# Altium schematic sheet Sheet1.SchDoc
size A4
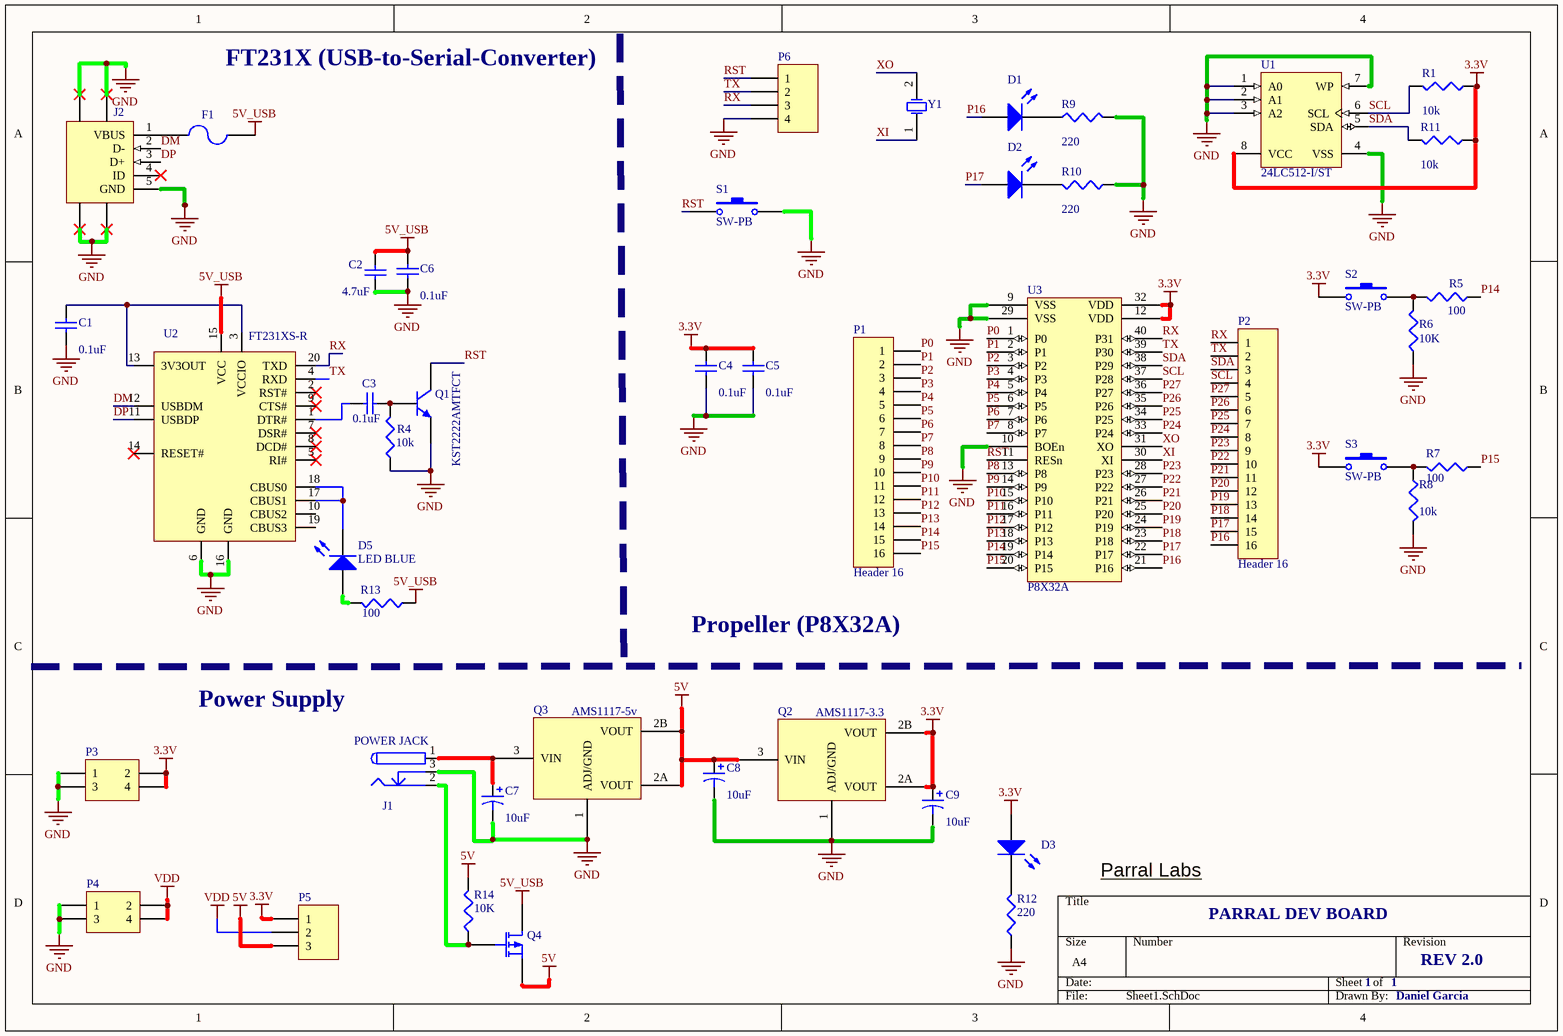
[diagram p0: Sheet1.SchDoc]

## Parts
C1  0.1uF  [0603 - Old1]
C2  4.7uF  [0603 - Old1]
C3  0.1uF  [0603 - Old1]
C4  0.1uF  [0603 - Old1]
C5  0.1uF  [0603 - Old1]
C6  0.1uF  [0603 - Old1]
C7  10uF  [C0805]
C8  10uF  [C0805]
C9  10uF  [C0805]
D1  LED GREEN  [LED-0603]  (value not drawn)
D2  LED BLUE  [LED-0603]  (value not drawn)
D3  LED RED  [LED-0603]  (value not drawn)
D5  LED BLUE  [LED-0603]
F1  PTC  [MF-MSMF050-2]  (value not drawn)
J1  POWER JACK  [PWR JACK]
J2  USB - micro B  [micro B USB 2.0]  (value not drawn)
P1  Header 16  [HDR1X16]
P2  Header 16  [HDR1X16]
P3  Header 2X2  [HDR2X2]  (value not drawn)
P4  Header 2X2  [HDR2X2]  (value not drawn)
P5  Header 3  [HDR1X3]  (value not drawn)
P6  Header 4  [HDR1X4]  (value not drawn)
Q1  KST2222AMTFCT  [SOT-23B_N]
Q2  AMS1117-3.3  [SOT223_M]
Q3  AMS1117-5v  [SOT223_M]
Q4  ZXMP6A13FTA  [SOT-23-3]  (value not drawn)
R1  10K  [0603-Resistor]
R4  10K  [0603-Resistor]
R5  100  [0603-Resistor]
R6  10K  [0603-Resistor]
R7  100  [0603-Resistor]
R8  10K  [0603-Resistor]
R9  220  [0603-Resistor]
R10  220  [0603-Resistor]
R11  10K  [0603-Resistor]
R12  220  [0603-Resistor]
R13  100  [0603-Resistor]
R14  10K  [0603-Resistor]
S1  SW-PB  [PTS810]
S2  SW-PB  [PTS810]
S3  SW-PB  [PTS810]
U1  24LC512-I/ST  [SOIC-8]
U2  FT231XS-R
U3  P8X32A  [DIP-40]
Y1  XTAL 5MHZ  [XTAL-2]  (value not drawn)

## Nets
3.3V: C4.2 C5.2 C9.1 D3.1(A) P3.2 P3.4 P5.1 Q2.2A(VOUT) Q2.2B(VOUT) R1.1 R11.1 S2.1 S3.1 U1.8(VCC) U3.12(VDD) U3.32(VDD)
5V: C8.1 P5.3 Q2.3(VIN) Q3.2A(VOUT) Q3.2B(VOUT) Q4.2(S) R14.2
5V_USB: C2.2 C6.2 F1.2 Q4.3(D) R13.1 U2.15(VCC)
GND: C1.1 C2.1 C4.1 C5.1 C6.1 C7.2 C8.2 C9.2 J1.3 J2.5(GND) J2.6 J2.7 J2.8 J2.9 P3.1 P3.3 P4.1 P4.3 P6.4 Q1.2(E) Q2.1(ADJ/GND) Q3.1(ADJ/GND) R4.1 R6.1 R8.2 R9.2 R10.1 R12.1 S1.2 U1.1(A0) U1.2(A1) U1.3(A2) U1.4(VSS) U1.7(WP) U2.6(GND) U2.16(GND) U3.9(VSS) U3.10(BOEn) U3.29(VSS)
VDD: P4.2 P4.4 P5.2
DM: J2.2(D-) U2.12(USBDM)
DP: J2.3(D+) U2.11(USBDP)
P0: P1.1 U3.1(P0)
P1: P1.2 U3.2(P1)
P2: P1.3 U3.3(P2)
P3: P1.4 U3.4(P3)
P4: P1.5 U3.5(P4)
P5: P1.6 U3.6(P5)
P6: P1.7 U3.7(P6)
P7: P1.8 U3.8(P7)
P8: P1.9 U3.13(P8)
P9: P1.10 U3.14(P9)
P10: P1.11 U3.15(P10)
P11: P1.12 U3.16(P11)
P12: P1.13 U3.17(P12)
P13: P1.14 U3.18(P13)
P14: P1.15 R5.1 U3.19(P14)
P15: P1.16 R7.1 U3.20(P15)
P16: D1.1(A) P2.16 U3.21(P16)
P17: D2.1(A) P2.15 U3.22(P17)
P18: P2.14 U3.23(P18)
P19: P2.13 U3.24(P19)
P20: P2.12 U3.25(P20)
P21: P2.11 U3.26(P21)
P22: P2.10 U3.27(P22)
P23: P2.9 U3.28(P23)
P24: P2.8 U3.33(P24)
P25: P2.7 U3.34(P25)
P26: P2.6 U3.35(P26)
P27: P2.5 U3.36(P27)
RST: P6.1 Q1.3(C) S1.1 U3.11(RESn)
RX: P2.1 P6.3 U2.20(TXD) U3.40(P31)
SCL: P2.4 R1.2 U1.6(SCL) U3.37(P28)
SDA: P2.3 R11.2 U1.5(SDA) U3.38(P29)
TX: P2.2 P6.2 U2.4(RXD) U3.39(P30)
XI: U3.30(XI) Y1.1(OSC1)
XO: U3.31(XO) Y1.2(OSC2)
NetC1_2: C1.2 U2.3(VCCIO) U2.13(3V3OUT)
NetC3_1: C3.1 U2.1(DTR#)
NetC3_2: C3.2 Q1.1(B) R4.2
NetC7_1: C7.1 J1.1 Q3.3(VIN)
NetD1_2: D1.2(K) R9.1
NetD2_2: D2.2(K) R10.2
NetD3_2: D3.2(K) R12.2
NetD5_1: D5.1(A) R13.2
NetD5_2: D5.2(K) U2.17(CBUS1) U2.18(CBUS0)
NetF1_1: F1.1 J2.1(VBUS)
NetJ1_2: J1.2 Q4.1(G) R14.1
NetR5_2: R5.2 R6.2 S2.2
NetR7_2: R7.2 R8.1 S3.2

Not connected (* = marked no-connect by the designer): J2 4(ID)*; U2 2(RST#)* 5(RI#)* 7(DSR#)* 8(DCD#)* 9(CTS#)* 10(CBUS2) 14(RESET#)* 19(CBUS3)

## Notes on the sheet
- FT231X (USB-to-Serial-Converter)
- Propeller (P8X32A)
- Power Supply
- Parral Labs
- PARRAL DEV BOARD
- 1
- REV 2.0
- Daniel Garcia

## Library data of the parts
C1 C3 C4 C6 = Cap Semi: 0.1uF Capacitor 0603; PartNumber: 478-1395-1-ND; Published: 8-Jun-2000; LatestRevisionDate: 29-May-2009; LatestRevisionNote: IPC-7351 Footprint Added.; PackageReference: 0603; Publisher: Altium Limited; PackageDescription: Chip Capacitor; Value: 0.1uF
C2 = Cap Semi: 4.7µF 25V Ceramic Capacitor X5R 0603; ManufacturerPartNumber: CL21A475KAQNNNE; Published: 8-Jun-2000; LatestRevisionDate: 29-May-2009; LatestRevisionNote: IPC-7351 Footprint Added.; PackageReference: 0603; Publisher: Altium Limited; PackageDescription: Chip Capacitor; Value: 4.7uF
C5 = Cap Semi: 0.1uF Capacitor 0603; Partnumber: 478-1395-1-ND; Published: 8-Jun-2000; LatestRevisionDate: 29-May-2009; LatestRevisionNote: IPC-7351 Footprint Added.; PackageReference: 0603; Publisher: Altium Limited; PackageDescription: Chip Capacitor; Value: 0.1uF
C7-C9 = Cap Pol3: 10µF Molded Tantalum Capacitors 10V 0805; PartNumber: 399-3684-1-ND; Published: 8-Jun-2000; LatestRevisionDate: 29-May-2009; LatestRevisionNote: IPC-7351 Footprint Added.; PackageReference: 0805; Publisher: Altium Limited; PackageDescription: Chip Capacitor; Value: 10uF
D1 D3 = LED2: LED 0603; Published: 8-Jun-2000; LatestRevisionDate: 17-Jul-2002; LatestRevisionNote: Re-released for DXP Platform.; PackageVersion: Feb-2002; PackageReference: 3.2X1.6X1.1; Publisher: Altium Limited; PackageDescription: SM LED; 2 Flat Leads
D2 D5 = LED0: LED 0603; Published: 8-Jun-2000; LatestRevisionDate: 08-Jul-2005; LatestRevisionNote: Mech Layer 1 removed.; PackageReference: LED-0; Publisher: Altium Limited; PackageDescription: LED; 2 Leads
F1 = Fuse 2: PTC RESETTABLE .50A 15V 1812; Manufacturer: Bourns Inc.; Current - Trip (It): 1A; Current - Hold (Ih) (Max): 500mA; Published: 8-Jun-2000; LatestRevisionDate: 17-Jul-2002; LatestRevisionNote: Re-released for DXP Platform.; Package / Case: 1812 (4532 Metric), Concave; Publisher: Altium Limited; PackageDescription: Thru-Hole; 2 Leads; Manufacturer Part Number: MF-MSMF050-2; Voltage - Max: 15V
J1 = Component_1: POWER JACK 5.5x2.1mm
J2 = USB MICRO B RECPT SMT: CONN USB MICRO B RECPT SMT R/A; Manufacturer Part Number: 10118192-0001LF; PartNumber: 609-4613-1-ND; Manufacturer: Amphenol FCI; Mounting Type: Surface Mount, Right Angle
P1 P2 = Header 16: Header, 16-Pin; LatestRevisionDate: 17-Jul-2002; LatestRevisionNote: Re-released for DXP Platform.; Publisher: Altium Limited
P3 P4 = Header 2X2: Header, 2-Pin, Dual row; LatestRevisionDate: 17-Jul-2002; LatestRevisionNote: Re-released for DXP Platform.; Publisher: Altium Limited
P5 = Header 3: Header, 3-Pin; LatestRevisionDate: 17-Jul-2002; LatestRevisionNote: Re-released for DXP Platform.; Publisher: Altium Limited
P6 = Header 4: Header, 4-Pin; LatestRevisionDate: 17-Jul-2002; LatestRevisionNote: Re-released for DXP Platform.; Publisher: Altium Limited
Q1 = QNPN: TRANS NPN 40V 0.6A SOT-23; Manufacturer: Fairchild/ON Semiconductor; Published: 8-Jun-2000; LatestRevisionDate: 29-May-2009; LatestRevisionNote: IPC-7351 Footprint Added.; PackageVersion: Aug-1999; PackageReference: SOT-23-3; Publisher: Altium Limited; PackageDescription: 3-Pin SOT-23 Package 0.95 mm Pitch, 2.4 mm Lead Span; Manufacturer Part Number: KST2222AMTF; Transistor Type: NPN
Q2 = AP1117E33GDICT-ND: Linear Voltage Regulator IC Positive Fixed 1 Output 3.3V; Manufacturer: Advanced Monolithic Systems; Current: 1A; Manufacturer Part Number: AMS1117-3.3; Package: SOT-223-3; Voltage - Output: 3.3V; Mounting Type: Surface Mount
Q3 = AP1117E33GDICT-ND: Linear Voltage Regulator IC Positive Fixed 1 Output 3.3V; Manufacturer Part Number: AMS1117-5.0; Manufacturer: Advanced Monolithic Systems; Voltage - Output: 5V; Current: 1A; Package: SOT-223-3; Mounting Type: Surface Mount
Q4 = MOSFET-P: MOSFET P-CH 60V 0.9A SOT23-3; Published: 8-Jun-2000; LatestRevisionDate: 17-Jul-2002; LatestRevisionNote: Re-released for DXP Platform.; PackageVersion: 1995/1996; PackageReference: E3; Publisher: Altium Limited; PackageDescription: TO, Flat Index; 3 In-Line, Axial Leads; Body Dia. 4.6mm; Lead Dia. 0.5 mm (max); Digi-Key Part Numbe: ZXMP6A13FCT-ND; Supplier Device Package: SOT-23-3
R1 R4 R8 R11 R14 = Res3: RES SMD 10K OHM 5% 1/4W 0603; Published: 8-Jun-2000; LatestRevisionDate: 29-May-2009; LatestRevisionNote: IPC-7351 Footprint Added.; PackageReference: J1-0603; Publisher: Altium Limited; PackageDescription: Chip Resistor
  R1 R4 R8 R11: Value: 10k
  R14: Value: 10K
R5 = Res3: RES SMD 100 OHM 5% 1/4W 0603; PartNumber: RMCF1206JT100RCT-ND; Published: 8-Jun-2000; LatestRevisionDate: 29-May-2009; LatestRevisionNote: IPC-7351 Footprint Added.; PackageReference: J1-0603; Publisher: Altium Limited; PackageDescription: Chip Resistor; Value: 100
R6 = Res3: RES SMD 10K OHM 5% 1/4W 0603; PartNumber: 311-10KERCT-ND; Published: 8-Jun-2000; LatestRevisionDate: 29-May-2009; LatestRevisionNote: IPC-7351 Footprint Added.; PackageReference: J1-0603; Publisher: Altium Limited; PackageDescription: Chip Resistor; Value: 10k
R7 R13 = Res3: RES SMD 100 OHM 5% 1/4W 0603; Published: 8-Jun-2000; LatestRevisionDate: 29-May-2009; LatestRevisionNote: IPC-7351 Footprint Added.; PackageReference: J1-0603; Publisher: Altium Limited; PackageDescription: Chip Resistor; Value: 100
R9 R10 = Res3: RES SMD 220 OHM 5% 1/4W 0603; Published: 8-Jun-2000; LatestRevisionDate: 29-May-2009; LatestRevisionNote: IPC-7351 Footprint Added.; PackageReference: J1-0603; Publisher: Altium Limited; PackageDescription: Chip Resistor; Value: 220
R12 = Res3: RES SMD 220 OHM 5% 1/4W 0603; PartNumber: er  P220ECT-ND; Published: 8-Jun-2000; LatestRevisionDate: 29-May-2009; LatestRevisionNote: IPC-7351 Footprint Added.; PackageReference: J1-0603; Publisher: Altium Limited; PackageDescription: Chip Resistor; Value: 220
S1-S3 = SW-PB: SWITCH TACTILE SPST-NO 0.05A 12V; Manufacturer Part Number: B3U-1000P; Manufacturer: Omron Electronics Inc-EMC Div; Published: 24-Mar-1999; LatestRevisionDate: 17-Jul-2002; LatestRevisionNote: Re-released for DXP Platform.; PackageReference: SPST-2; Publisher: Altium Limited; PackageDescription: Switch; 2 Leads
U1 = 24LC256-I/ST: IC EEPROM 512KBIT 400KHZ 8SOIJ; Manufacturer Part Number: 24LC512-I/ST-ND; Published: 29-Jan-2009; DatasheetVersion: revP, Oct-2007; PackageVersion: revBB, Aug-2009; PackageReference: TSSOP-ST8; Publisher: Altium Limited; PackageDescription: 8-Lead Plastic Thin Shrink Small Outline (ST) - 4.4mm Body [TSSOP]; Supplier 1: Digi-Key; Supplier 2: Farnell; Supplier Part Number 2: 1296579; Code_JEDEC: MO-153; ComponentLink1Description: Datasheet; ComponentLink1URL: http://ww1.microchip.com/downloads/en/DeviceDoc/21203P.pdf; ComponentLink2Description: Packaging Specification; ComponentLink2URL: http://www.microchip.com/stellent/groups/techpub_sg/documents/packagingspec/en012702.pdf; ComponentLink3Description: Microchip.com Home; ComponentLink3URL: http://www.microchip.com/
U2 = FT231XS-R: IC USB SERIAL FULL UART 20SSOP; Manufacturer: FTDI, Future Technology Devices International Ltd; Voltage - Supply: 3.3 V ~ 5 V; Categories: Integrated Circuits (ICs)   Interface - Controllers; Part Number: FT231XS-R; Package / Case: 20-SSOP (0.154", 3.90mm Width); Interface: UART; Operating Temperature: -40°C ~ 85°C; Digi-Key Part Number: 768-1129-1-ND
U3 = P8X32A-D40: Propeller™ Microcontroller IC 32-Bit 80MHz 32KB (32K x 8) ROM; Manufacturer: PARALLAX INC; Manufacturer Part Number: P8X32A-D40; DigiKey PN: P8X32A-D40-ND; Speed: 80MHz; Package / Case: 40-DIP; Family: Embedded - Microcontrollers
Y1 = XTAL: CRYSTAL 5.0000MHZ 18PF T/H; Partnumber: 300-6009-ND; Manufacturer: Citizen Finedevice Co Ltd; Published: 8-Jun-2000; LatestRevisionDate: 17-Jul-2002; LatestRevisionNote: Re-released for DXP Platform.; PackageReference: R38; Publisher: Altium Limited; PackageDescription: Crystal, Thru-Hole; 2 Leads; Body 3.1 x 8.2 mm (Dia.xH); Package: HC49/US; Frequency: 5MHz; Type: MHz Crystal